# EAGLE design ProjectV5 (EAGLE 9.5.2)
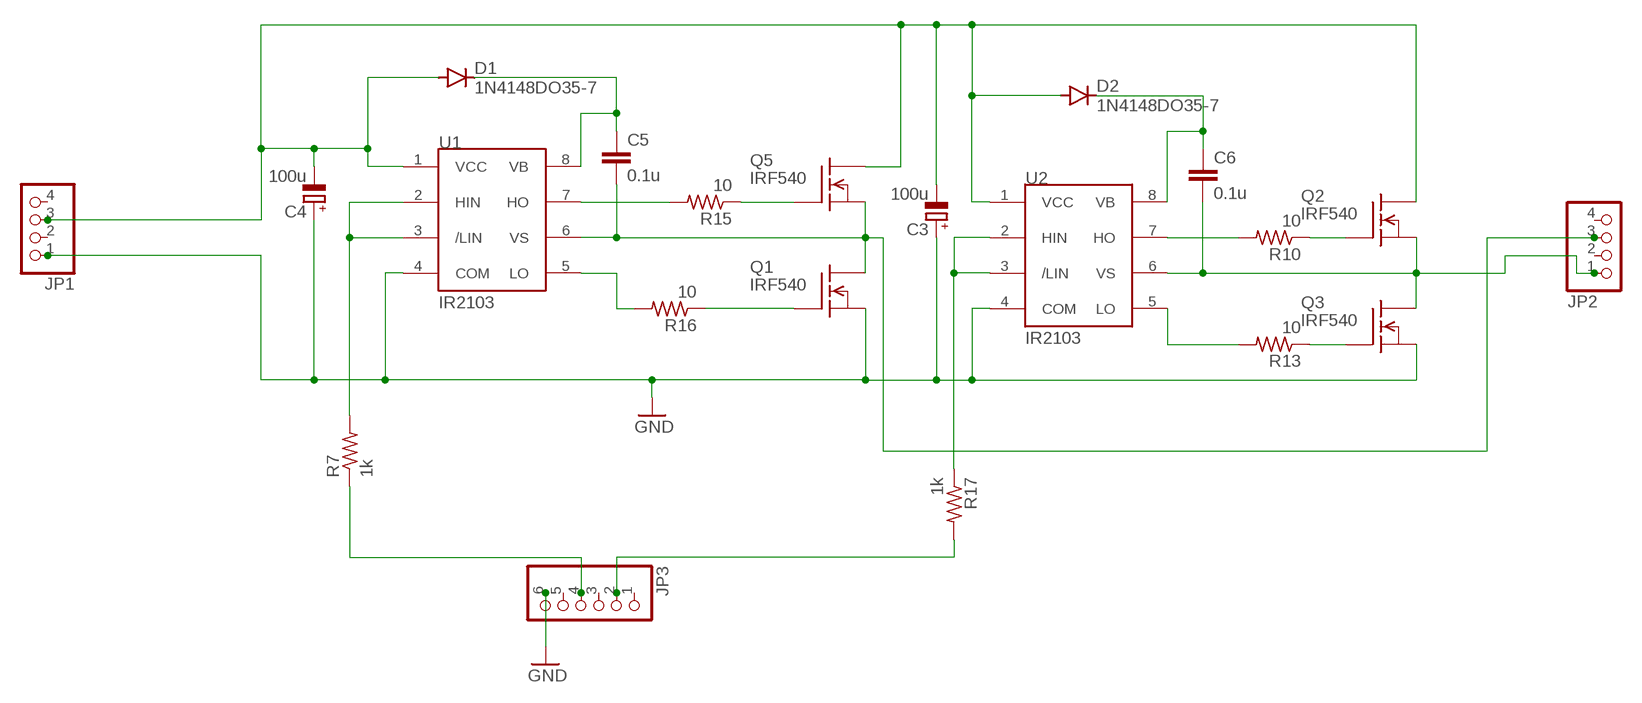
[diagram p0: schematic, sheet 1]

## Parts
C3  100u  CPOL-EUE2.5-6  [E2,5-6]
C4  100u  CPOL-EUE2.5-6  [E2,5-6]
C5  0.1u  C-EU050-030X075  [C050-030X075]
C6  0.1u  C-EU050-030X075  [C050-030X075]
D1  1N4148DO35-7  [DO35-7]
D2  1N4148DO35-7  [DO35-7]
JP1  PINHD-1X4  [1X04]
JP2  PINHD-1X4  [1X04]
JP3  PINHD-1X6  [1X06]
Q1  IRF540  [TO220]
Q2  IRF540  [TO220]
Q3  IRF540  [TO220]
Q5  IRF540  [TO220]
R7  1k  R-US_0309/12  [0309/12]
R10  10  R-US_0309/12  [0309/12]
R13  10  R-US_0309/12  [0309/12]
R15  10  R-US_0309/12  [0309/12]
R16  10  R-US_0309/12  [0309/12]
R17  1k  R-US_0309/12  [0309/12]
U1  IR2103  [DIL08]
U2  IR2103  [DIL08]

## Nets
GND: C3.+ C4.+ JP1.1 JP3.6 Q1.3(S) Q3.3(S) U1.4(COM) U2.4(COM)
LEGA: C5.2 JP2.3 Q1.2(D) Q5.3(S) U1.6(VS)
LEGB: C6.2 JP2.1 Q2.3(S) Q3.2(D) U2.6(VS)
N$1: Q3.1(G) R13.1
N$2: Q2.1(G) R10.1
N$3: R10.2 U2.7(HO)
N$4: R13.2 U2.5(LO)
N$5: R15.2 U1.7(HO)
N$6: Q1.1(G) R16.1
N$9: R16.2 U1.5(LO)
N$10: R17.1 U2.2(HIN) U2.3(/LIN)
N$12: Q5.1(G) R15.1
N$15: JP3.2 R17.2
N$16: JP3.4 R7.1
N$17: R7.2 U1.2(HIN) U1.3(/LIN)
VB: C5.1 C6.1 D1.C D2.C U1.8(VB) U2.8(VB)
VCC: C3.- C4.- D1.A D2.A JP1.3 Q2.2(D) Q5.2(D) U1.1(VCC) U2.1(VCC)
Unconnected: JP1.2 JP1.4 JP2.2 JP2.4 JP3.1 JP3.3 JP3.5

## Library data of the parts
C3 C4 = rcl:CPOL-EU: POLARIZED CAPACITOR, European symbol; SPICEPREFIX: C
C5 C6 = rcl:C-EU: CAPACITOR, European symbol; SPICEPREFIX: C
D1 D2 = diode:1N4148: DIODE high speed (Philips)
JP1 JP2 = pinhead:PINHD-1X4: PIN HEADER
JP3 = pinhead:PINHD-1X6: PIN HEADER
Q1-Q3 Q5 = transistor-fet:IRF540: N-Channel Enhancement MOSFET (HEXFET); 100V; 28A; 0,077Ohm
R7 R10 R13 R15-R17 = rcl:R-US_: RESISTOR, American symbol; SPICEPREFIX: R
U1 U2 = irf:IR2103: High and low side driver

## Net classes
0 default: width 0.305 mm, drill 0.508 mm, clearance 0.508 mm

## Board
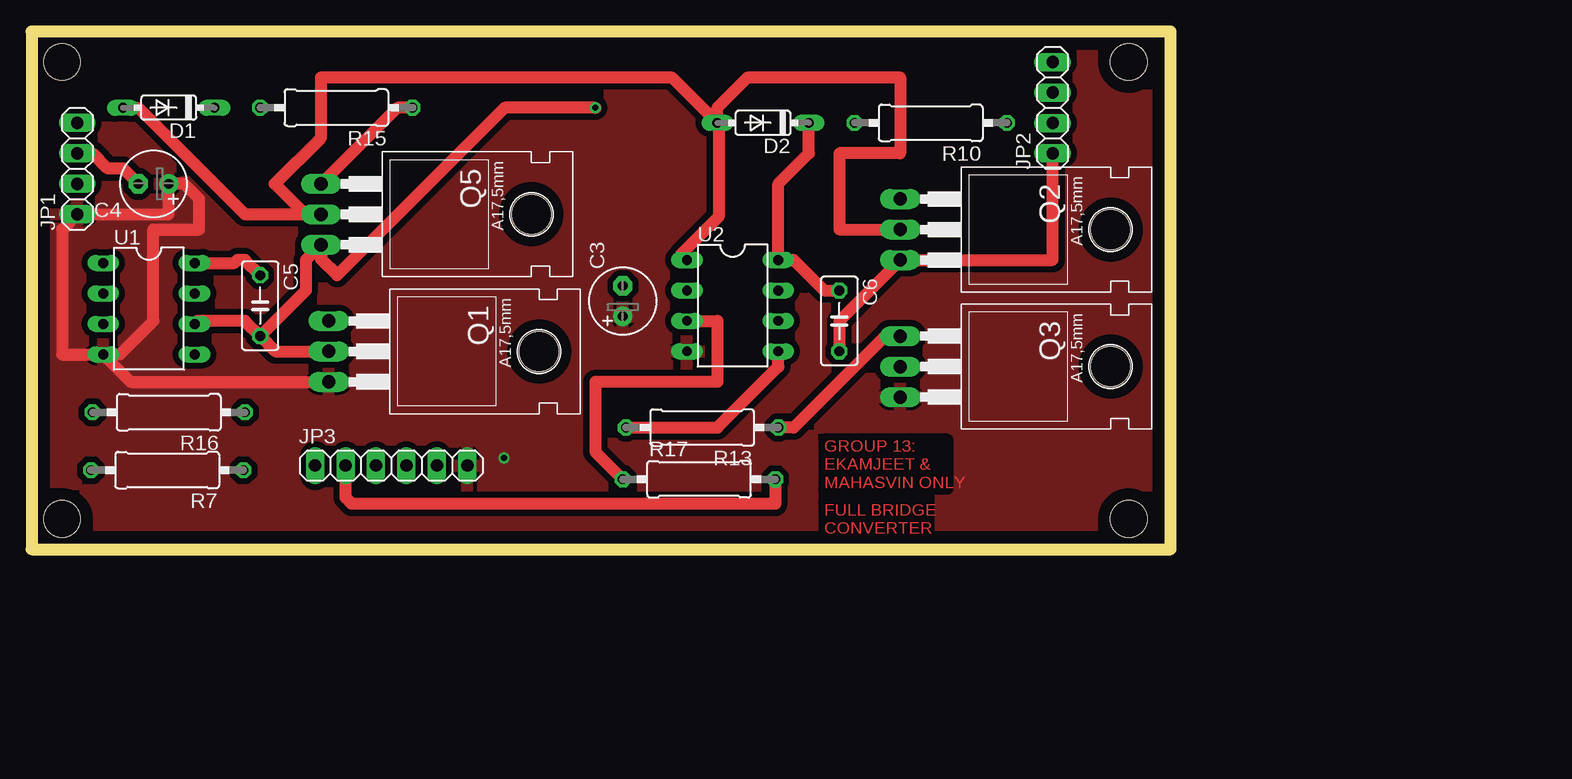
[diagram p1: board, top side]
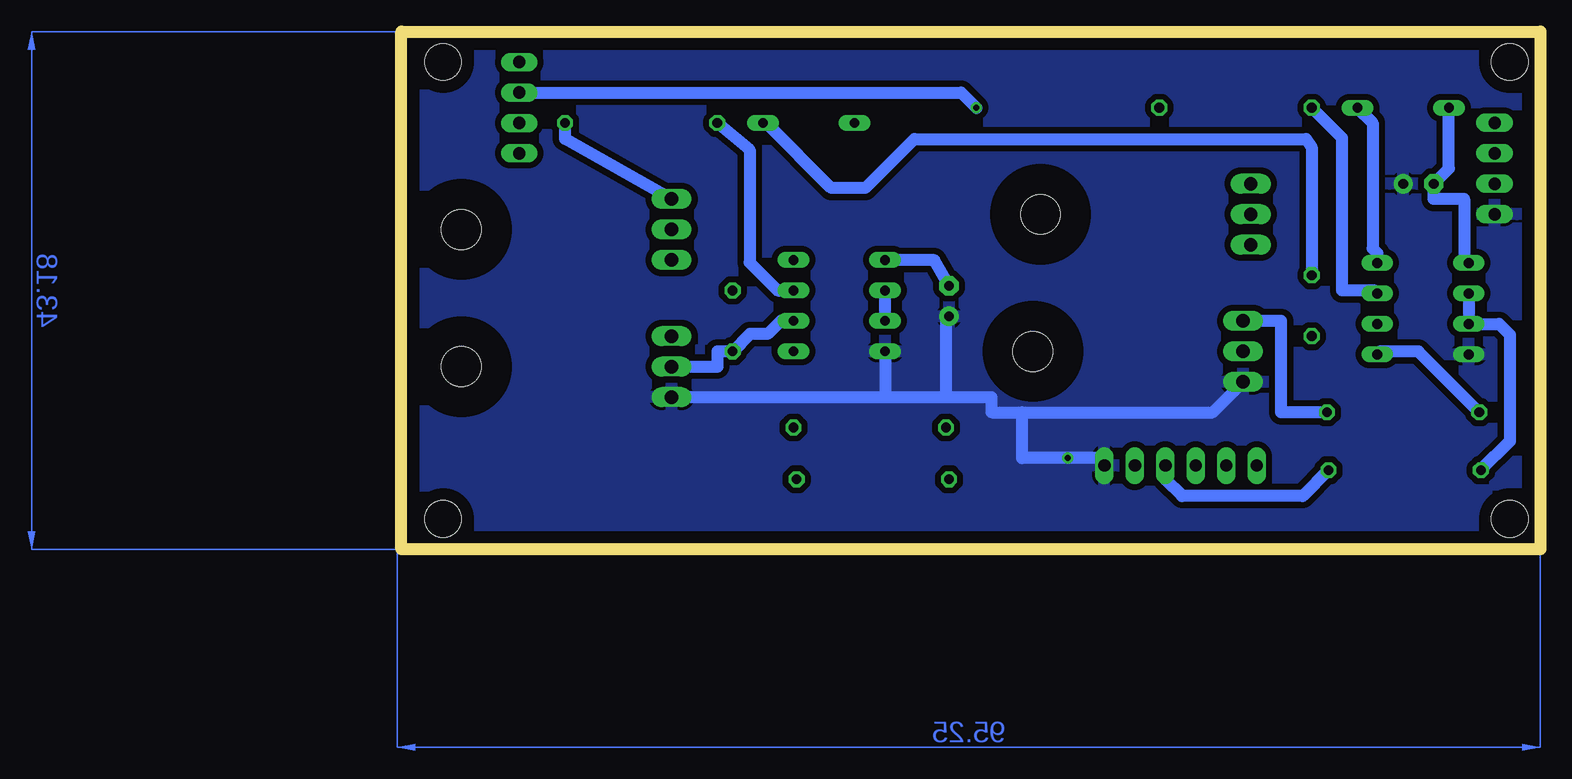
[diagram p2: board, bottom side, seen from below]

Size 94.92 x 43.17 mm. Coordinates in mm from the lower left corner, seen from the top.
Outline: 0,0 94.92,0 94.92,43.17 0,43.17 0,0
Copper layers (1*16): Top 0.035mm / dielectric 1.5mm / Bottom 0.035mm
Design rules "default": minimum track width 6mil, minimum drill 0.35mm, track to track 6mil, track to pad 6mil, pad to pad 6mil, via to via 6mil, smd to smd 6mil, copper to edge 40mil, drill to drill 6mil, minimum pad ring 10mil, minimum via ring 8mil, stop-mask expansion 4mil, vias tented up to drill 0mil, thermal gap 10mil
Holes 3.05 mm at 2.54,2.54 2.54,40.64 91.44,40.64 91.44,2.54

### Footprints (pad centres in the part's own frame; a part is rotated, then mirrored left to right if it is on the bottom)
E2,5-6 = drill 0.813 pad 1.6: + -1.27,0 | drill 0.813 pad 1.6 octagon: - 1.27,0
C050-030X075 = drill 0.813 octagon: 1 -2.54,0; 2 2.54,0
DO35-7 = drill 0.813 long: A 3.81,0; C -3.81,0
1X04 = drill 1.016 long: 1 -3.81,0; 2 -1.27,0; 3 1.27,0; 4 3.81,0
1X06 = drill 1.016 long: 1 -6.35,0; 2 -3.81,0; 3 -1.27,0; 4 1.27,0; 5 3.81,0; 6 6.35,0
TO220 = drill 1.118 long: 1 -2.54,-6.35; 2 0,-6.35; 3 2.54,-6.35 | hole 3.302: 0,11.176
0309/12 = drill 0.813 octagon: 1 -6.35,0; 2 6.35,0
DIL08 = drill 0.813 long: 1 -3.81,-3.81; 2 -1.27,-3.81; 3 1.27,-3.81; 4 3.81,-3.81; 5 3.81,3.81; 6 1.27,3.81; 7 -1.27,3.81; 8 -3.81,3.81

### Placement (x,y rotation side)
C3  49.28,20.7 90 top
C4  10.16,30.48 180 top
C5  19.05,20.32 270 top
C6  67.31,19.05 270 top
D1  11.43,36.83 180 top
D2  60.96,35.56 180 top
JP1  3.81,31.75 90 top
JP2  85.09,36.83 90 top
JP3  29.97,6.98 0 top
Q1  31.12,16.51 270 top
Q2  78.74,26.67 270 top
Q3  78.74,15.24 270 top
Q5  30.48,27.94 270 top
R7  11.3,6.6 180 top
R10  74.93,35.56 180 top
R13  55.88,10.16 180 top
R15  25.4,36.83 180 top
R16  11.43,11.43 180 top
R17  55.63,5.84 0 top
U1  9.78,20.07 270 top
U2  58.42,20.32 270 top

### Tracks (layer width: path | path; a pad name or v marks a point on that pad's centre or on a via)
GND  (via drill 0.51)
  Top 1.016: U1.4 7.37,16.26 10.16,19.05 10.16,26.67 13.97,26.67 13.97,29.21 12.7,30.48 C4.+ 11.43,27.94 JP1.1 2.54,26.67 2.54,16.26 U1.4 | U1.4 8.25,13.97 Q1.3
  Bottom 1.016: Q1.3 27.3,11.43 43.18,11.43 | Q3.3 54.61,12.7 | 54.61,12.7 49.53,12.7 | 49.53,12.7 45.72,12.7 45.72,11.43 43.18,11.43 | C3.+ 49.53,19.18 49.53,12.7 | U2.4 54.61,12.7 | 43.18,11.43 43.18,7.62 v39.37,7.62 36.96,7.62 JP3.6
  pour Top: 0,43.18 0,0 95.25,0 95.25,43.18
  pour Bottom: 0,43.18 0,0 95.25,0 95.25,43.18
LEGA  (via drill 0.51)
  Top 1.016: C5.2 22.86,21.59 22.86,24.13 Q5.3 24.13,24.18 25.46,22.86 39.43,36.83 v46.99,36.83 | U1.6 13.84,19.05 17.78,19.05 C5.2 | C5.2 20.32,16.51 Q1.2
  Bottom 1.016: JP2.3 48.26,38.1 v46.99,36.83
LEGB
  Top 1.016: C6.2 67.31,19.05 Q2.3 85.09,24.13 JP2.1
  Bottom 1.016: U2.6 63.3,19.05 64.39,17.96 65.86,17.96 C6.2 68.58,16.51 68.58,15.24 Q3.2
N$1
  Top 1.016: Q3.1 71.12,17.78 63.5,10.16 R13.1
N$2
  Bottom 1.016: R10.1 81.28,34.24 Q2.1
N$3
  Bottom 1.016: U2.7 63.55,21.59 65.89,23.93 65.89,33.32 R10.2
N$4
  Top 1.016: U2.5 62.23,15.24 57.15,10.16 R13.2
N$5
  Bottom 1.016: U1.7 13.84,21.59 16.51,21.59 16.51,34.29 R15.2
N$6
  Bottom 1.016: R16.1 21.59,11.43 21.59,19.05 Q1.1
N$9
  Bottom 1.016: R16.2 10.16,16.51 13.34,16.51 U1.5
N$10
  Top 1.016: R17.1 46.99,8.13 46.99,13.97 57.15,13.97 57.15,19.05 U2.3
  Bottom 1.016: U2.3 U2.2
N$12
  Top 1.016: Q5.1 30.48,36.83 R15.1
N$15
  Top 1.016: R17.2 61.98,3.81 26.67,3.81 26.16,4.32 JP3.2
N$16
  Bottom 1.016: R7.1 19.81,4.45 29.84,4.45 31.24,5.84 JP3.4
N$17
  Bottom 1.016: U1.2 U1.3 3.43,18.8 2.54,17.91 2.54,9.02 R7.2
VB
  Top 1.016: D2.C 64.77,33.02 62.23,30.48 U2.8 63.5,24.13 66.04,21.59 C6.1 | U1.8 16.89,23.88 17.14,24.13 17.78,24.13 C5.1
  Bottom 1.016: C5.1 19.05,33.54 19.51,34.21 52.17,34.21 56.26,30.12 59.08,30.12 64.52,35.56 D2.C | D1.C 13.97,35.56 13.97,25.08 13.59,24.7 U1.8
VCC
  Top 1.016: D2.A 57.25,35.56 57.25,27.74 54.18,24.66 54.18,24.38 54.46,24.1 U2.1 | D2.A 57.15,36.83 59.69,39.37 72.39,39.37 72.39,33.02 67.31,33.02 67.31,26.67 Q2.2 | D2.A 53.34,39.37 24.13,39.37 24.13,34.35 20.26,30.48 22.8,27.94 Q5.2 17.78,27.94 8.89,36.83 D1.A | C4.- 7.62,31.75 6.35,31.75 5.08,33.02 JP1.3
  Bottom 1.016: U2.1 54.46,24.1 50.49,24.1 C3.- | U1.1 6.35,24.26 6.35,29.21 8.89,29.21 C4.- 7.62,31.75 D1.A
(copper drawn outside any net)
  shapes: Bottom area x2

### Text on the board
Top: GROUP 13: / EKAMJEET & / MAHASVIN ONLY | FULL BRIDGE / CONVERTER